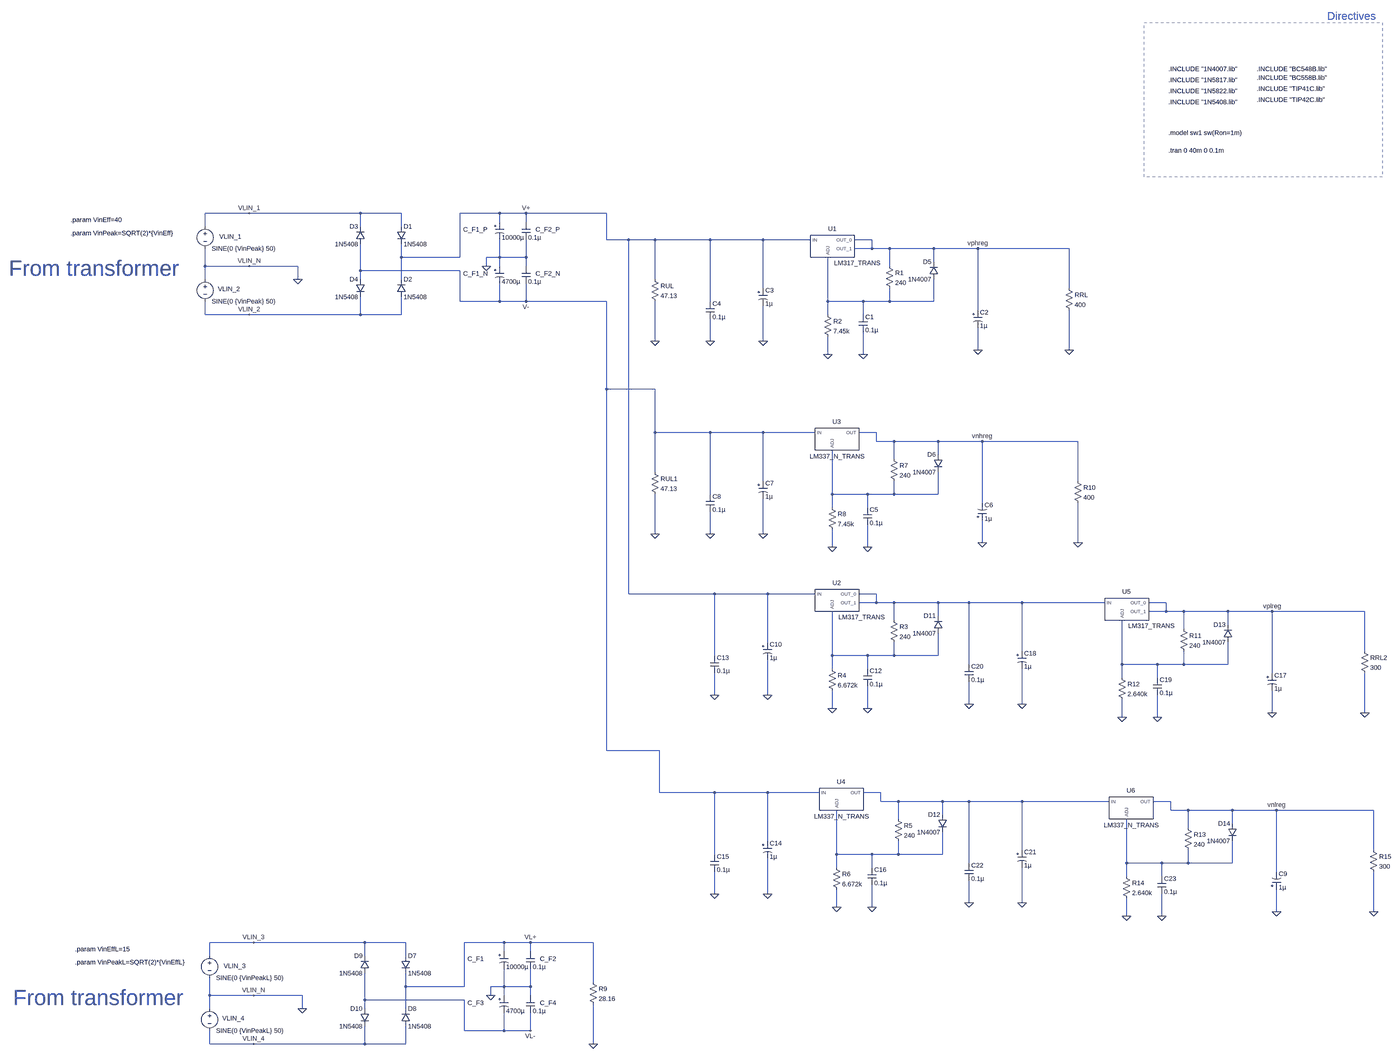
[diagram p0: schematic power_supply_F_V_0.1.asc, whole sheet]
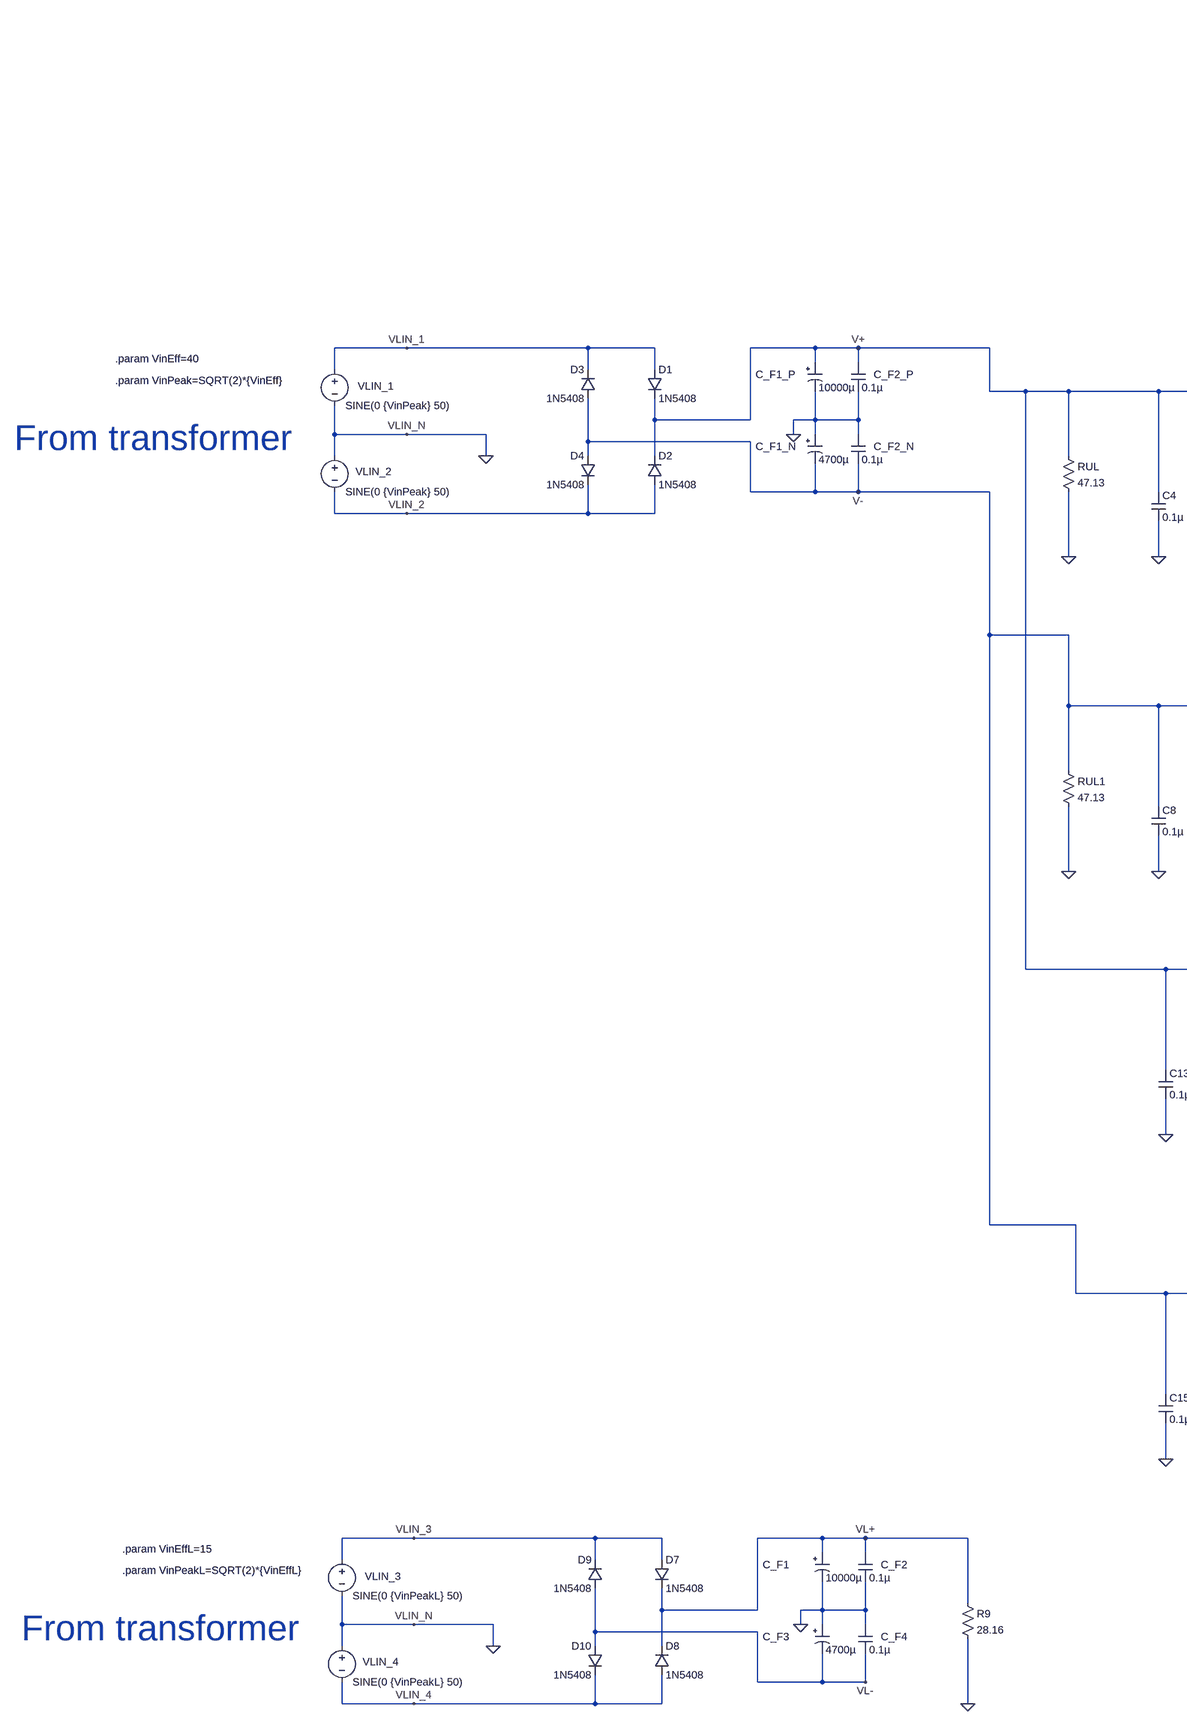
[diagram p1: schematic power_supply_F_V_0.1.asc, part, row 1 of 1, column 1 of 2]
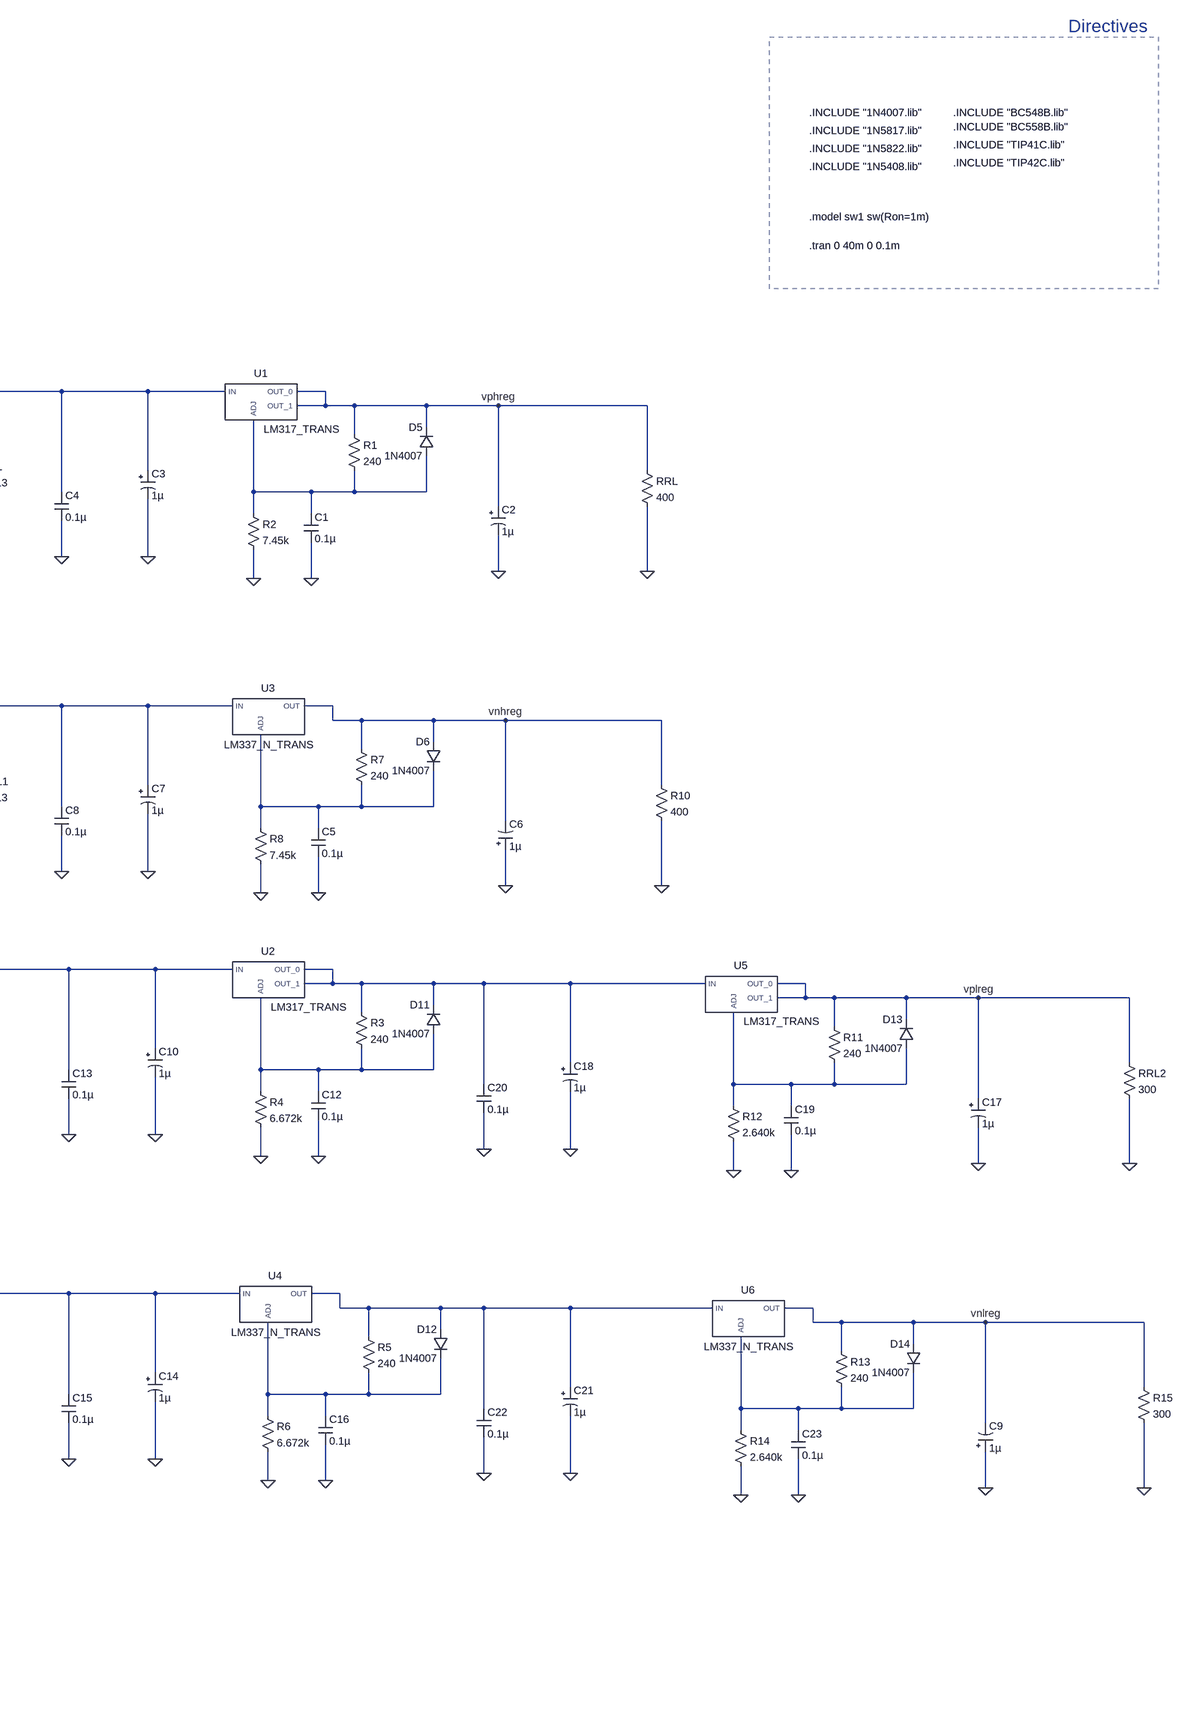
[diagram p2: schematic power_supply_F_V_0.1.asc, part, row 1 of 1, column 2 of 2]
power_supply_F_V_0.1.asc, the LTspice schematic file:
Version 4
SHEET 1 5728 3116
WIRE -96 -544 -256 -544
WIRE 752 -544 -96 -544
WIRE 912 -544 752 -544
WIRE 1280 -544 1136 -544
WIRE 1376 -544 1280 -544
WIRE 1696 -544 1376 -544
WIRE 1280 -512 1280 -544
WIRE 1376 -512 1376 -544
WIRE -256 -496 -256 -544
WIRE 752 -496 752 -544
WIRE 912 -496 912 -544
WIRE 1696 -448 1696 -544
WIRE 1776 -448 1696 -448
WIRE 1872 -448 1776 -448
WIRE 2112 -448 1872 -448
WIRE 2304 -448 2112 -448
WIRE 2608 -448 2304 -448
WIRE 2832 -448 2768 -448
WIRE 2832 -416 2832 -448
WIRE 2832 -416 2768 -416
WIRE 2896 -416 2832 -416
WIRE 3056 -416 2896 -416
WIRE 3216 -416 3056 -416
WIRE 3552 -416 3216 -416
WIRE 912 -384 912 -432
WIRE 1136 -384 1136 -544
WIRE 1136 -384 912 -384
WIRE 1280 -384 1280 -448
WIRE 1280 -384 1232 -384
WIRE 1376 -384 1376 -448
WIRE 1376 -384 1280 -384
WIRE 3056 -368 3056 -416
WIRE -256 -352 -256 -416
WIRE -96 -352 -256 -352
WIRE 80 -352 -96 -352
WIRE 1232 -352 1232 -384
WIRE 1280 -352 1280 -384
WIRE 1376 -352 1376 -384
WIRE 2896 -352 2896 -416
WIRE 752 -336 752 -432
WIRE 1136 -336 752 -336
WIRE -256 -304 -256 -352
WIRE 80 -304 80 -352
WIRE 752 -304 752 -336
WIRE 912 -304 912 -384
WIRE 1872 -304 1872 -448
WIRE 2304 -272 2304 -448
WIRE 3552 -272 3552 -416
WIRE 1136 -224 1136 -336
WIRE 1280 -224 1280 -288
WIRE 1280 -224 1136 -224
WIRE 1376 -224 1376 -288
WIRE 1376 -224 1280 -224
WIRE 1696 -224 1376 -224
WIRE 2112 -224 2112 -448
WIRE 2672 -224 2672 -384
WIRE 2800 -224 2672 -224
WIRE 2896 -224 2896 -272
WIRE 2896 -224 2800 -224
WIRE 3056 -224 3056 -304
WIRE 3056 -224 2896 -224
WIRE 3216 -192 3216 -416
WIRE -256 -176 -256 -224
WIRE -96 -176 -256 -176
WIRE 752 -176 752 -240
WIRE 752 -176 -96 -176
WIRE 912 -176 912 -240
WIRE 912 -176 752 -176
WIRE 2672 -176 2672 -224
WIRE 2800 -176 2800 -224
WIRE 1872 -80 1872 -224
WIRE 2112 -80 2112 -160
WIRE 2304 -80 2304 -208
WIRE 3216 -48 3216 -128
WIRE 3552 -48 3552 -192
WIRE 2672 -32 2672 -96
WIRE 2800 -32 2800 -112
WIRE 1696 224 1696 -224
WIRE 1872 224 1696 224
WIRE 1872 480 1872 224
WIRE 2112 480 1872 480
WIRE 2304 480 2112 480
WIRE 2624 480 2304 480
WIRE 2848 480 2784 480
WIRE 2848 512 2848 480
WIRE 2912 512 2848 512
WIRE 3072 512 2912 512
WIRE 3232 512 3072 512
WIRE 3584 512 3232 512
WIRE 3072 560 3072 512
WIRE 2912 576 2912 512
WIRE 1872 624 1872 480
WIRE 2304 656 2304 480
WIRE 3584 656 3584 512
WIRE 2112 704 2112 480
WIRE 2688 704 2688 544
WIRE 2816 704 2688 704
WIRE 2912 704 2912 656
WIRE 2912 704 2816 704
WIRE 3072 704 3072 624
WIRE 3072 704 2912 704
WIRE 3232 736 3232 512
WIRE 2688 752 2688 704
WIRE 2816 752 2816 704
WIRE 1872 848 1872 704
WIRE 2112 848 2112 768
WIRE 2304 848 2304 720
WIRE 3232 880 3232 800
WIRE 3584 880 3584 736
WIRE 2688 896 2688 832
WIRE 2816 896 2816 816
WIRE 1776 1232 1776 -448
WIRE 2128 1232 1776 1232
WIRE 2320 1232 2128 1232
WIRE 2624 1232 2320 1232
WIRE 2848 1232 2784 1232
WIRE 2848 1264 2848 1232
WIRE 2848 1264 2784 1264
WIRE 2912 1264 2848 1264
WIRE 3072 1264 2912 1264
WIRE 3184 1264 3072 1264
WIRE 3376 1264 3184 1264
WIRE 3680 1264 3376 1264
WIRE 3904 1264 3840 1264
WIRE 3904 1296 3904 1264
WIRE 3904 1296 3840 1296
WIRE 3968 1296 3904 1296
WIRE 4128 1296 3968 1296
WIRE 4288 1296 4128 1296
WIRE 4624 1296 4288 1296
WIRE 3072 1312 3072 1264
WIRE 2912 1328 2912 1264
WIRE 4128 1344 4128 1296
WIRE 3968 1360 3968 1296
WIRE 2320 1408 2320 1232
WIRE 3376 1440 3376 1264
WIRE 4624 1440 4624 1296
WIRE 2128 1456 2128 1232
WIRE 2688 1456 2688 1296
WIRE 2816 1456 2688 1456
WIRE 2912 1456 2912 1408
WIRE 2912 1456 2816 1456
WIRE 3072 1456 3072 1376
WIRE 3072 1456 2912 1456
WIRE 3184 1488 3184 1264
WIRE 3744 1488 3744 1328
WIRE 3872 1488 3744 1488
WIRE 3968 1488 3968 1440
WIRE 3968 1488 3872 1488
WIRE 4128 1488 4128 1408
WIRE 4128 1488 3968 1488
WIRE 2688 1504 2688 1456
WIRE 2816 1504 2816 1456
WIRE 4288 1520 4288 1296
WIRE 3744 1536 3744 1488
WIRE 3872 1536 3872 1488
WIRE 2128 1600 2128 1520
WIRE 2320 1600 2320 1472
WIRE 3184 1632 3184 1552
WIRE 3376 1632 3376 1504
WIRE 2688 1648 2688 1584
WIRE 2816 1648 2816 1568
WIRE 4288 1664 4288 1584
WIRE 4624 1664 4624 1520
WIRE 3744 1680 3744 1616
WIRE 3872 1680 3872 1600
WIRE 1696 1904 1696 224
WIRE 1888 1904 1696 1904
WIRE 1888 2160 1888 1904
WIRE 2128 2160 1888 2160
WIRE 2320 2160 2128 2160
WIRE 2640 2160 2320 2160
WIRE 2864 2160 2800 2160
WIRE 2864 2192 2864 2160
WIRE 2928 2192 2864 2192
WIRE 3088 2192 2928 2192
WIRE 3184 2192 3088 2192
WIRE 3376 2192 3184 2192
WIRE 3696 2192 3376 2192
WIRE 3920 2192 3856 2192
WIRE 3920 2224 3920 2192
WIRE 3984 2224 3920 2224
WIRE 4144 2224 3984 2224
WIRE 4304 2224 4144 2224
WIRE 4656 2224 4304 2224
WIRE 3088 2240 3088 2192
WIRE 2928 2256 2928 2192
WIRE 4144 2272 4144 2224
WIRE 3984 2288 3984 2224
WIRE 2320 2336 2320 2160
WIRE 3376 2368 3376 2192
WIRE 4656 2368 4656 2224
WIRE 2128 2384 2128 2160
WIRE 2704 2384 2704 2224
WIRE 2832 2384 2704 2384
WIRE 2928 2384 2928 2336
WIRE 2928 2384 2832 2384
WIRE 3088 2384 3088 2304
WIRE 3088 2384 2928 2384
WIRE 3184 2416 3184 2192
WIRE 3760 2416 3760 2256
WIRE 3888 2416 3760 2416
WIRE 3984 2416 3984 2368
WIRE 3984 2416 3888 2416
WIRE 4144 2416 4144 2336
WIRE 4144 2416 3984 2416
WIRE 2704 2432 2704 2384
WIRE 2832 2432 2832 2384
WIRE 4304 2448 4304 2224
WIRE 3760 2464 3760 2416
WIRE 3888 2464 3888 2416
WIRE 2128 2528 2128 2448
WIRE 2320 2528 2320 2400
WIRE 3184 2560 3184 2480
WIRE 3376 2560 3376 2432
WIRE 2704 2576 2704 2512
WIRE 2832 2576 2832 2496
WIRE 4304 2592 4304 2512
WIRE 4656 2592 4656 2448
WIRE 3760 2608 3760 2544
WIRE 3888 2608 3888 2528
WIRE -80 2704 -240 2704
WIRE 768 2704 -80 2704
WIRE 928 2704 768 2704
WIRE 1296 2704 1152 2704
WIRE 1392 2704 1296 2704
WIRE 1648 2704 1392 2704
WIRE 1296 2736 1296 2704
WIRE 1392 2736 1392 2704
WIRE -240 2752 -240 2704
WIRE 768 2752 768 2704
WIRE 928 2752 928 2704
WIRE 1648 2848 1648 2704
WIRE 928 2864 928 2816
WIRE 1152 2864 1152 2704
WIRE 1152 2864 928 2864
WIRE 1296 2864 1296 2800
WIRE 1296 2864 1248 2864
WIRE 1392 2864 1392 2800
WIRE 1392 2864 1296 2864
WIRE -240 2896 -240 2832
WIRE -80 2896 -240 2896
WIRE 96 2896 -80 2896
WIRE 1248 2896 1248 2864
WIRE 1296 2896 1296 2864
WIRE 1392 2896 1392 2864
WIRE 768 2912 768 2816
WIRE 1152 2912 768 2912
WIRE -240 2944 -240 2896
WIRE 96 2944 96 2896
WIRE 768 2944 768 2912
WIRE 928 2944 928 2864
WIRE 1152 3024 1152 2912
WIRE 1296 3024 1296 2960
WIRE 1296 3024 1152 3024
WIRE 1392 3024 1392 2960
WIRE 1392 3024 1296 3024
WIRE -240 3072 -240 3024
WIRE -80 3072 -240 3072
WIRE 768 3072 768 3008
WIRE 768 3072 -80 3072
WIRE 928 3072 928 3008
WIRE 928 3072 768 3072
WIRE 1648 3072 1648 2928
FLAG -96 -544 VLIN_1
FLAG -96 -176 VLIN_2
FLAG -96 -352 VLIN_N
FLAG 80 -304 0
FLAG 1376 -224 V-
FLAG 1376 -544 V+
FLAG 1232 -352 0
FLAG 2672 -32 0
FLAG 2800 -32 0
FLAG 3216 -48 0
FLAG 2304 -80 0
FLAG 3216 -416 vphreg
FLAG 2688 896 0
FLAG 2816 896 0
FLAG 3232 880 0
FLAG 3584 880 0
FLAG 3232 512 vnhreg
FLAG 2112 -80 0
FLAG 3552 -48 0
FLAG 1872 -80 0
FLAG 2304 848 0
FLAG 2112 848 0
FLAG 1872 848 0
FLAG 2688 1648 0
FLAG 2816 1648 0
FLAG 2320 1600 0
FLAG 2704 2576 0
FLAG 2832 2576 0
FLAG 2128 1600 0
FLAG 2320 2528 0
FLAG 2128 2528 0
FLAG 3744 1680 0
FLAG 3872 1680 0
FLAG 4288 1664 0
FLAG 3376 1632 0
FLAG 4288 1296 vplreg
FLAG 3184 1632 0
FLAG 4624 1664 0
FLAG 3760 2608 0
FLAG 3888 2608 0
FLAG 4304 2592 0
FLAG 4656 2592 0
FLAG 4304 2224 vnlreg
FLAG 3376 2560 0
FLAG 3184 2560 0
FLAG -80 2704 VLIN_3
FLAG -80 3072 VLIN_4
FLAG -80 2896 VLIN_N
FLAG 96 2944 0
FLAG 1392 3024 VL-
FLAG 1392 2704 VL+
FLAG 1248 2896 0
FLAG 1648 3072 0
SYMBOL voltage -256 -512 R0
WINDOW 123 0 0 Left 2
WINDOW 39 0 0 Left 2
WINDOW 0 51 53 Left 2
SYMATTR InstName VLIN_1
SYMATTR Value SINE(0 {VinPeak} 50)
SYMBOL diode 896 -496 R0
SYMATTR InstName D1
SYMATTR Value 1N5408
SYMBOL diode 896 -240 M180
WINDOW 0 24 64 Left 2
WINDOW 3 24 0 Left 2
SYMATTR InstName D2
SYMATTR Value 1N5408
SYMBOL polcap 1264 -512 R0
WINDOW 0 -116 27 Left 2
WINDOW 3 24 56 Left 2
SYMATTR InstName C_F1_P
SYMATTR Value 10000µ
SYMATTR Description Capacitor
SYMATTR Type cap
SYMATTR SpiceLine V=35 Irms=1.45 Rser=0.044 Lser=0 mfg="Nichicon" pn="UPR1V222MRH" type="Al electrolytic"
SYMBOL cap 1360 -512 R0
WINDOW 0 50 27 Left 2
SYMATTR InstName C_F2_P
SYMATTR Value 0.1µ
SYMATTR SpiceLine V=4 Irms=1.62 Rser=0.0464862 Lser=0 mfg="KEMET" pn="C0402C104K7PAC" type="X5R"
SYMBOL diode 768 -432 R180
WINDOW 0 24 64 Left 2
WINDOW 3 24 0 Left 2
SYMATTR InstName D3
SYMATTR Value 1N5408
SYMBOL diode 768 -304 M0
SYMATTR InstName D4
SYMATTR Value 1N5408
SYMBOL voltage -256 -320 R0
WINDOW 123 0 0 Left 2
WINDOW 39 0 0 Left 2
WINDOW 0 46 51 Left 2
SYMATTR InstName VLIN_2
SYMATTR Value SINE(0 {VinPeak} 50)
SYMBOL polcap 1264 -352 R0
WINDOW 0 -116 27 Left 2
WINDOW 3 24 56 Left 2
SYMATTR InstName C_F1_N
SYMATTR Value 4700µ
SYMATTR Description Capacitor
SYMATTR Type cap
SYMATTR SpiceLine V=35 Irms=1.45 Rser=0.044 Lser=0 mfg="Nichicon" pn="UPR1V222MRH" type="Al electrolytic"
SYMBOL cap 1360 -352 R0
WINDOW 0 50 27 Left 2
SYMATTR InstName C_F2_N
SYMATTR Value 0.1µ
SYMATTR SpiceLine V=4 Irms=1.62 Rser=0.0464862 Lser=0 mfg="KEMET" pn="C0402C104K7PAC" type="X5R"
SYMBOL LM317_TRANS 2688 -432 R0
WINDOW 3 91 53 Top 2
SYMATTR InstName U1
SYMBOL diode 3072 -304 R180
WINDOW 0 24 64 Left 2
WINDOW 3 24 0 Left 2
SYMATTR InstName D5
SYMATTR Value 1N4007
SYMBOL res 2880 -368 R0
SYMATTR InstName R1
SYMATTR Value 240
SYMBOL res 2656 -192 R0
SYMATTR InstName R2
SYMATTR Value 7.45k
SYMBOL polcap 3200 -192 R0
SYMATTR InstName C2
SYMATTR Value 1µ
SYMBOL polcap 2288 -272 R0
SYMATTR InstName C3
SYMATTR Value 1µ
SYMBOL diode 3088 560 M0
SYMATTR InstName D6
SYMATTR Value 1N4007
SYMBOL res 2896 560 R0
SYMATTR InstName R7
SYMATTR Value 240
SYMBOL res 2672 736 R0
SYMATTR InstName R8
SYMATTR Value 7.45k
SYMBOL polcap 3216 800 M180
WINDOW 0 24 57 Left 2
WINDOW 3 24 8 Left 2
SYMATTR InstName C6
SYMATTR Value 1µ
SYMBOL res 3568 640 R0
SYMATTR InstName R10
SYMATTR Value 400
SYMBOL LM337_N_TRANS 2704 496 R0
SYMATTR InstName U3
SYMBOL res 3536 -288 R0
SYMATTR InstName RRL
SYMATTR Value 400
SYMBOL cap 2784 -176 R0
SYMATTR InstName C1
SYMATTR Value 0.1µ
SYMBOL cap 2096 -224 R0
SYMATTR InstName C4
SYMATTR Value 0.1µ
SYMBOL res 1856 -320 R0
SYMATTR InstName RUL
SYMATTR Value 47.13
SYMBOL polcap 2288 656 R0
SYMATTR InstName C7
SYMATTR Value 1µ
SYMBOL cap 2096 704 R0
SYMATTR InstName C8
SYMATTR Value 0.1µ
SYMBOL res 1856 608 R0
SYMATTR InstName RUL1
SYMATTR Value 47.13
SYMBOL cap 2800 752 R0
SYMATTR InstName C5
SYMATTR Value 0.1µ
SYMBOL LM317_TRANS 2704 1248 R0
WINDOW 3 91 53 Top 2
SYMATTR InstName U2
SYMBOL diode 3088 1376 R180
WINDOW 0 24 64 Left 2
WINDOW 3 24 0 Left 2
SYMATTR InstName D11
SYMATTR Value 1N4007
SYMBOL res 2896 1312 R0
SYMATTR InstName R3
SYMATTR Value 240
SYMBOL res 2672 1488 R0
SYMATTR InstName R4
SYMATTR Value 6.672k
SYMBOL polcap 2304 1408 R0
SYMATTR InstName C10
SYMATTR Value 1µ
SYMBOL diode 3104 2240 M0
SYMATTR InstName D12
SYMATTR Value 1N4007
SYMBOL res 2912 2240 R0
SYMATTR InstName R5
SYMATTR Value 240
SYMBOL res 2688 2416 R0
SYMATTR InstName R6
SYMATTR Value 6.672k
SYMBOL LM337_N_TRANS 2720 2176 R0
SYMATTR InstName U4
SYMBOL cap 2800 1504 R0
SYMATTR InstName C12
SYMATTR Value 0.1µ
SYMBOL cap 2112 1456 R0
SYMATTR InstName C13
SYMATTR Value 0.1µ
SYMBOL polcap 2304 2336 R0
SYMATTR InstName C14
SYMATTR Value 1µ
SYMBOL cap 2112 2384 R0
SYMATTR InstName C15
SYMATTR Value 0.1µ
SYMBOL cap 2816 2432 R0
SYMATTR InstName C16
SYMATTR Value 0.1µ
SYMBOL LM317_TRANS 3760 1280 R0
WINDOW 3 91 53 Top 2
SYMATTR InstName U5
SYMBOL diode 4144 1408 R180
WINDOW 0 24 64 Left 2
WINDOW 3 24 0 Left 2
SYMATTR InstName D13
SYMATTR Value 1N4007
SYMBOL res 3952 1344 R0
SYMATTR InstName R11
SYMATTR Value 240
SYMBOL res 3728 1520 R0
SYMATTR InstName R12
SYMATTR Value 2.640k
SYMBOL polcap 4272 1520 R0
SYMATTR InstName C17
SYMATTR Value 1µ
SYMBOL polcap 3360 1440 R0
SYMATTR InstName C18
SYMATTR Value 1µ
SYMBOL res 4608 1424 R0
SYMATTR InstName RRL2
SYMATTR Value 300
SYMBOL cap 3856 1536 R0
SYMATTR InstName C19
SYMATTR Value 0.1µ
SYMBOL cap 3168 1488 R0
SYMATTR InstName C20
SYMATTR Value 0.1µ
SYMBOL diode 4160 2272 M0
SYMATTR InstName D14
SYMATTR Value 1N4007
SYMBOL res 3968 2272 R0
SYMATTR InstName R13
SYMATTR Value 240
SYMBOL res 3744 2448 R0
SYMATTR InstName R14
SYMATTR Value 2.640k
SYMBOL polcap 4288 2512 M180
WINDOW 0 24 57 Left 2
WINDOW 3 24 8 Left 2
SYMATTR InstName C9
SYMATTR Value 1µ
SYMBOL res 4640 2352 R0
SYMATTR InstName R15
SYMATTR Value 300
SYMBOL LM337_N_TRANS 3776 2208 R0
SYMATTR InstName U6
SYMBOL polcap 3360 2368 R0
SYMATTR InstName C21
SYMATTR Value 1µ
SYMBOL cap 3168 2416 R0
SYMATTR InstName C22
SYMATTR Value 0.1µ
SYMBOL cap 3872 2464 R0
SYMATTR InstName C23
SYMATTR Value 0.1µ
SYMBOL voltage -240 2736 R0
WINDOW 123 0 0 Left 2
WINDOW 39 0 0 Left 2
WINDOW 0 51 53 Left 2
SYMATTR InstName VLIN_3
SYMATTR Value SINE(0 {VinPeakL} 50)
SYMBOL diode 912 2752 R0
SYMATTR InstName D7
SYMATTR Value 1N5408
SYMBOL diode 912 3008 M180
WINDOW 0 24 64 Left 2
WINDOW 3 24 0 Left 2
SYMATTR InstName D8
SYMATTR Value 1N5408
SYMBOL polcap 1280 2736 R0
WINDOW 0 -116 27 Left 2
WINDOW 3 24 56 Left 2
SYMATTR InstName C_F1
SYMATTR Value 10000µ
SYMATTR Description Capacitor
SYMATTR Type cap
SYMATTR SpiceLine V=35 Irms=1.45 Rser=0.044 Lser=0 mfg="Nichicon" pn="UPR1V222MRH" type="Al electrolytic"
SYMBOL cap 1376 2736 R0
WINDOW 0 50 27 Left 2
SYMATTR InstName C_F2
SYMATTR Value 0.1µ
SYMATTR SpiceLine V=4 Irms=1.62 Rser=0.0464862 Lser=0 mfg="KEMET" pn="C0402C104K7PAC" type="X5R"
SYMBOL diode 784 2816 R180
WINDOW 0 24 64 Left 2
WINDOW 3 24 0 Left 2
SYMATTR InstName D9
SYMATTR Value 1N5408
SYMBOL diode 784 2944 M0
SYMATTR InstName D10
SYMATTR Value 1N5408
SYMBOL voltage -240 2928 R0
WINDOW 123 0 0 Left 2
WINDOW 39 0 0 Left 2
WINDOW 0 46 51 Left 2
SYMATTR InstName VLIN_4
SYMATTR Value SINE(0 {VinPeakL} 50)
SYMBOL polcap 1280 2896 R0
WINDOW 0 -116 27 Left 2
WINDOW 3 24 56 Left 2
SYMATTR InstName C_F3
SYMATTR Value 4700µ
SYMATTR Description Capacitor
SYMATTR Type cap
SYMATTR SpiceLine V=35 Irms=1.45 Rser=0.044 Lser=0 mfg="Nichicon" pn="UPR1V222MRH" type="Al electrolytic"
SYMBOL cap 1376 2896 R0
WINDOW 0 50 27 Left 2
SYMATTR InstName C_F4
SYMATTR Value 0.1µ
SYMATTR SpiceLine V=4 Irms=1.62 Rser=0.0464862 Lser=0 mfg="KEMET" pn="C0402C104K7PAC" type="X5R"
SYMBOL res 1632 2832 R0
SYMATTR InstName R9
SYMATTR Value 28.16
TEXT -968 -344 Left 6 ;From transformer
TEXT 3912 -1232 Left 2 !.tran 0 40m 0 0.1m
TEXT 3912 -1528 Left 2 !.INCLUDE "1N4007.lib"
TEXT 3912 -1488 Left 2 !.INCLUDE "1N5817.lib"
TEXT 3912 -1448 Left 2 !.INCLUDE "1N5822.lib"
TEXT 3912 -1296 Left 2 !.model sw1 sw(Ron=1m)
TEXT 4488 -1720 Left 4 ;Directives
TEXT 3912 -1408 Left 2 !.INCLUDE "1N5408.lib"
TEXT -744 -520 Left 2 !.param VinEff=40
TEXT -744 -472 Left 2 !.param VinPeak=SQRT(2)*{VinEff}
TEXT 4232 -1528 Left 2 !.INCLUDE "BC548B.lib"
TEXT 4232 -1496 Left 2 !.INCLUDE "BC558B.lib"
TEXT 4232 -1456 Left 2 !.INCLUDE "TIP41C.lib"
TEXT 4232 -1416 Left 2 !.INCLUDE "TIP42C.lib"
TEXT -952 2904 Left 6 ;From transformer
TEXT -728 2728 Left 2 !.param VinEffL=15
TEXT -728 2776 Left 2 !.param VinPeakL=SQRT(2)*{VinEffL}
RECTANGLE Normal 4688 -1136 3824 -1696 3

The netlist it stands for:
* power_supply_F_V_0.1.asc
VLIN_1 VLIN_1 0 SINE(0 {VinPeak} 50)
D1 VLIN_1 V+ 1N5408
D2 VLIN_2 V+ 1N5408
C_F1_P V+ 0 10000µ V=35 Irms=1.45 Rser=0.044 Lser=0 mfg="Nichicon" pn="UPR1V222MRH" type="Al electrolytic"
C_F2_P V+ 0 0.1µ V=4 Irms=1.62 Rser=0.0464862 Lser=0 mfg="KEMET" pn="C0402C104K7PAC" type="X5R"
D3 V- VLIN_1 1N5408
D4 V- VLIN_2 1N5408
VLIN_2 0 VLIN_2 SINE(0 {VinPeak} 50)
C_F1_N 0 V- 4700µ V=35 Irms=1.45 Rser=0.044 Lser=0 mfg="Nichicon" pn="UPR1V222MRH" type="Al electrolytic"
C_F2_N 0 V- 0.1µ V=4 Irms=1.62 Rser=0.0464862 Lser=0 mfg="KEMET" pn="C0402C104K7PAC" type="X5R"
XU1 V+ N001 vphreg vphreg LM317_TRANS  ; pins IN ADJ OUT_0 OUT_1
D5 N001 vphreg 1N4007
R1 vphreg N001 240
R2 N001 0 7.45k
C2 vphreg 0 1µ
C3 V+ 0 1µ
D6 vnhreg N002 1N4007
R7 vnhreg N002 240
R8 N002 0 7.45k
C6 0 vnhreg 1µ
R10 vnhreg 0 400
XU3 V- N002 vnhreg LM337_N_TRANS  ; pins IN ADJ OUT
RRL vphreg 0 400
C1 N001 0 0.1µ
C4 V+ 0 0.1µ
RUL V+ 0 47.13
C7 V- 0 1µ
C8 V- 0 0.1µ
RUL1 V- 0 47.13
C5 N002 0 0.1µ
XU2 V+ N004 N003 N003 LM317_TRANS  ; pins IN ADJ OUT_0 OUT_1
D11 N004 N003 1N4007
R3 N003 N004 240
R4 N004 0 6.672k
C10 V+ 0 1µ
D12 N006 N007 1N4007
R5 N006 N007 240
R6 N007 0 6.672k
XU4 V- N007 N006 LM337_N_TRANS  ; pins IN ADJ OUT
C12 N004 0 0.1µ
C13 V+ 0 0.1µ
C14 V- 0 1µ
C15 V- 0 0.1µ
C16 N007 0 0.1µ
XU5 N003 N005 vplreg vplreg LM317_TRANS  ; pins IN ADJ OUT_0 OUT_1
D13 N005 vplreg 1N4007
R11 vplreg N005 240
R12 N005 0 2.640k
C17 vplreg 0 1µ
C18 N003 0 1µ
RRL2 vplreg 0 300
C19 N005 0 0.1µ
C20 N003 0 0.1µ
D14 vnlreg N008 1N4007
R13 vnlreg N008 240
R14 N008 0 2.640k
C9 0 vnlreg 1µ
R15 vnlreg 0 300
XU6 N006 N008 vnlreg LM337_N_TRANS  ; pins IN ADJ OUT
C21 N006 0 1µ
C22 N006 0 0.1µ
C23 N008 0 0.1µ
VLIN_3 VLIN_3 0 SINE(0 {VinPeakL} 50)
D7 VLIN_3 VL+ 1N5408
D8 VLIN_4 VL+ 1N5408
C_F1 VL+ 0 10000µ V=35 Irms=1.45 Rser=0.044 Lser=0 mfg="Nichicon" pn="UPR1V222MRH" type="Al electrolytic"
C_F2 VL+ 0 0.1µ V=4 Irms=1.62 Rser=0.0464862 Lser=0 mfg="KEMET" pn="C0402C104K7PAC" type="X5R"
D9 VL- VLIN_3 1N5408
D10 VL- VLIN_4 1N5408
VLIN_4 0 VLIN_4 SINE(0 {VinPeakL} 50)
C_F3 0 VL- 4700µ V=35 Irms=1.45 Rser=0.044 Lser=0 mfg="Nichicon" pn="UPR1V222MRH" type="Al electrolytic"
C_F4 0 VL- 0.1µ V=4 Irms=1.62 Rser=0.0464862 Lser=0 mfg="KEMET" pn="C0402C104K7PAC" type="X5R"
R9 VL+ 0 28.16
.model D D
.lib standard.dio
* From transformer
.tran 0 40m 0 0.1m
.INCLUDE "1N4007.lib"
.INCLUDE "1N5817.lib"
.INCLUDE "1N5822.lib"
.model sw1 sw(Ron=1m)
* Directives
.INCLUDE "1N5408.lib"
.param VinEff=40
.param VinPeak=SQRT(2)*{VinEff}
.INCLUDE "BC548B.lib"
.INCLUDE "BC558B.lib"
.INCLUDE "TIP41C.lib"
.INCLUDE "TIP42C.lib"
* From transformer
.param VinEffL=15
.param VinPeakL=SQRT(2)*{VinEffL}
.lib LM317_TRANS.LIB
.lib LM337_N_TRANS.LIB
.backanno
.end